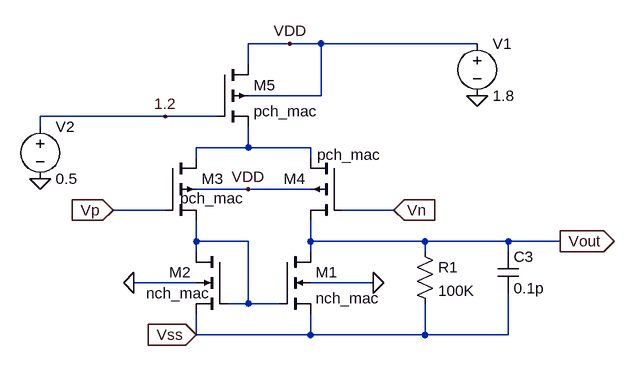
[diagram p0: schematic RNN_Sigmoid5_HA_v3.asc]
RNN_Sigmoid5_HA_v3.asc, the LTspice schematic file:
Version 4
SHEET 1 880 724
WIRE 288 -144 224 -144
WIRE 336 -144 288 -144
WIRE 576 -144 336 -144
WIRE 224 -112 224 -144
WIRE 336 -64 336 -144
WIRE 336 -64 224 -64
WIRE 96 -32 -96 -32
WIRE 176 -32 96 -32
WIRE -96 -16 -96 -32
WIRE 224 16 224 -16
WIRE 224 16 144 16
WIRE 320 16 224 16
WIRE 144 32 144 16
WIRE 320 32 320 16
WIRE 224 80 144 80
WIRE 320 80 224 80
WIRE 96 112 16 112
WIRE 448 112 368 112
WIRE 144 160 144 128
WIRE 224 160 144 160
WIRE 320 160 320 128
WIRE 496 160 320 160
WIRE 624 160 496 160
WIRE 704 160 624 160
WIRE 144 176 144 160
WIRE 320 176 320 160
WIRE 496 176 496 160
WIRE 624 176 624 160
WIRE 144 224 48 224
WIRE 416 224 320 224
WIRE 224 256 224 160
WIRE 224 256 192 256
WIRE 272 256 224 256
WIRE 144 304 144 272
WIRE 320 304 320 272
WIRE 320 304 144 304
WIRE 496 304 496 256
WIRE 496 304 320 304
WIRE 624 304 624 240
WIRE 624 304 496 304
FLAG 96 -32 1.2
FLAG 704 160 Vout
IOPIN 704 160 Out
FLAG 16 112 Vp
IOPIN 16 112 In
FLAG 224 80 VDD
FLAG 288 -144 VDD
FLAG -96 64 0
FLAG 576 -64 0
FLAG 48 224 0
FLAG 416 224 0
FLAG 448 112 Vn
IOPIN 448 112 In
FLAG 144 304 Vss
IOPIN 144 304 In
SYMBOL nmos4 272 176 R0
SYMATTR InstName M1
SYMATTR Value nch_mac
SYMATTR Value2 l=2u w=1u
SYMBOL nmos4 192 176 M0
WINDOW 3 27 64 Left 2
SYMATTR Value nch_mac
SYMATTR InstName M2
SYMATTR Value2 l=2u w=1u
SYMBOL pmos4 96 32 R0
WINDOW 3 23 62 Left 2
SYMATTR Value pch_mac
SYMATTR InstName M3
SYMATTR Value2 l=4u w=3u
SYMBOL pmos4 368 32 M0
WINDOW 3 -60 -5 Left 2
SYMATTR Value pch_mac
SYMATTR InstName M4
SYMATTR Value2 l=4u w=3u
SYMBOL pmos4 176 -112 R0
SYMATTR InstName M5
SYMATTR Value pch_mac
SYMATTR Value2 l=2u w=5.7u
SYMBOL res 480 160 R0
SYMATTR InstName R1
SYMATTR Value 100K
SYMBOL voltage 576 -160 R0
WINDOW 123 0 0 Left 0
WINDOW 39 0 0 Left 0
SYMATTR InstName V1
SYMATTR Value 1.8
SYMBOL voltage -96 -32 R0
WINDOW 123 0 0 Left 0
WINDOW 39 0 0 Left 0
SYMATTR InstName V2
SYMATTR Value 0.5
SYMBOL cap 608 176 R0
SYMATTR InstName C3
SYMATTR Value 0.1p

The netlist it stands for:
* RNN_Sigmoid5_HA_v3.asc
M1 Vout N002 Vss 0 nch_mac l=2u w=1u
M2 N002 N002 Vss 0 nch_mac l=2u w=1u
M3 N001 Vp N002 VDD pch_mac l=4u w=3u
M4 N001 Vn Vout VDD pch_mac l=4u w=3u
M5 VDD 1.2 N001 VDD pch_mac l=2u w=5.7u
R1 Vout Vss 100K
V1 VDD 0 1.8
V2 1.2 0 0.5
C3 Vout Vss 0.1p
.model NMOS NMOS
.model PMOS PMOS
.lib standard.mos
.backanno
.end